# Altium project TE0706.PrjPCB
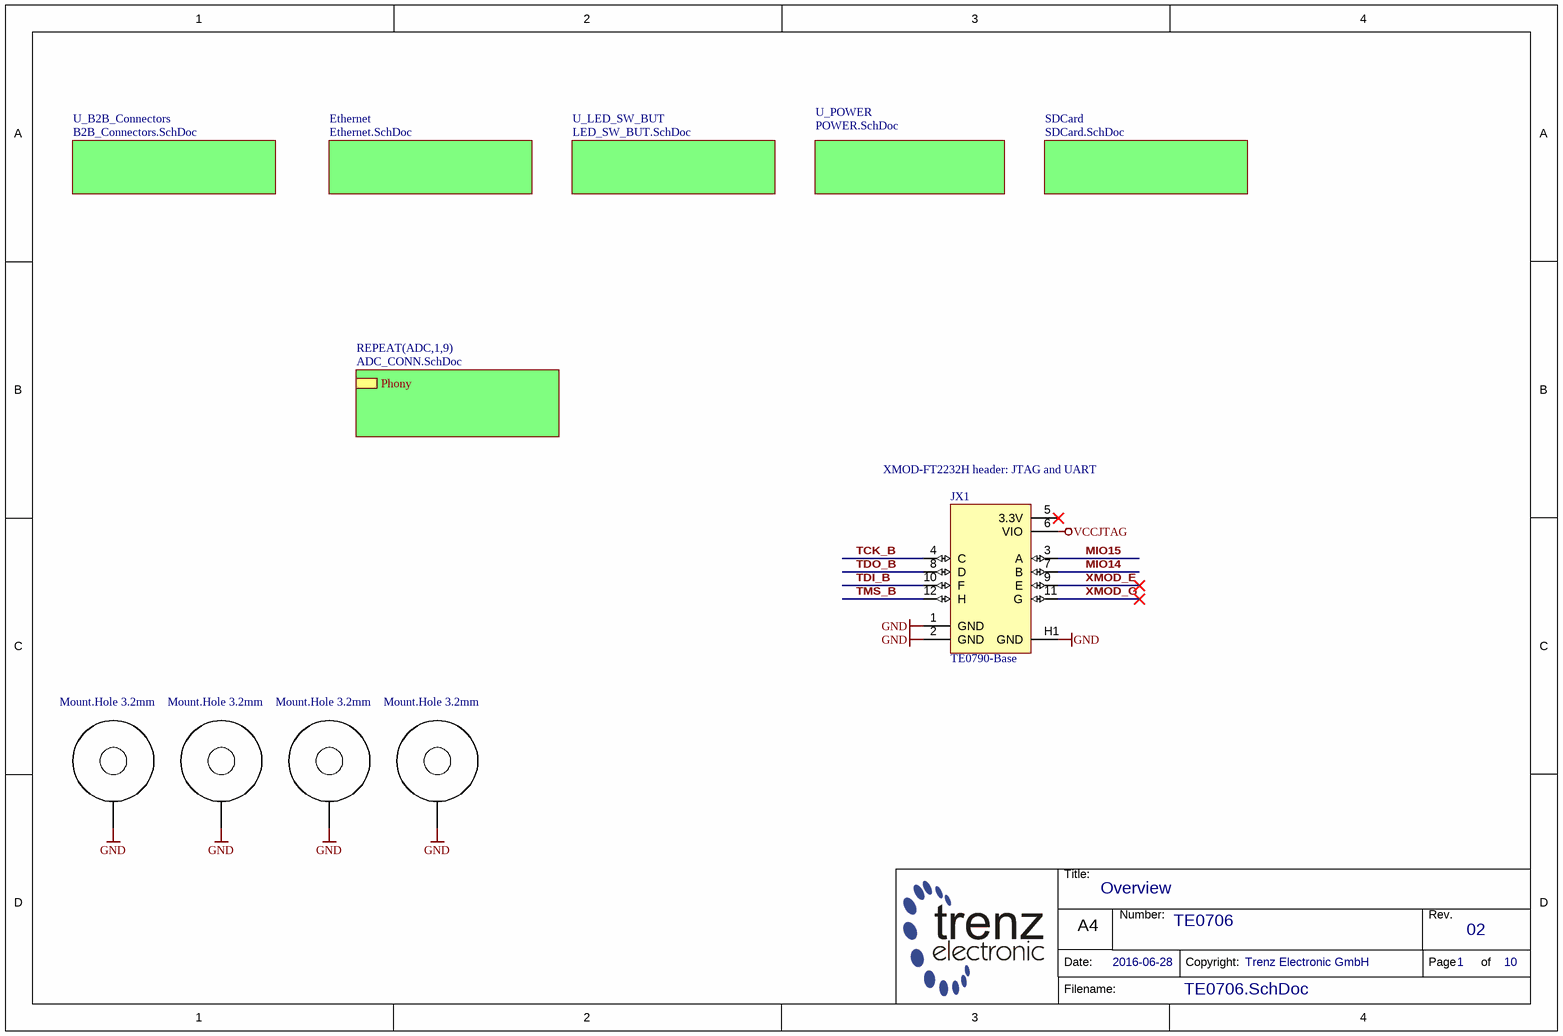
[diagram p0: TE0706.SchDoc]
PrjRev: 01; PrjName: TE0706
7 sheets, 69 parts. Net scope: hierarchical (ports join the sheet entries above them; power ports are global).
Board file: TE0706.PcbDoc
Sheets:
  TE0706.SchDoc
    Ethernet = Ethernet.SchDoc
    SDCard = SDCard.SchDoc
    U_B2B_Connectors = B2B_Connectors.SchDoc
    U_POWER = POWER.SchDoc
    U_LED_SW_BUT = LED_SW_BUT.SchDoc
    ADC1 = ADC_CONN.SchDoc
    ADC2 = ADC_CONN.SchDoc
    ADC3 = ADC_CONN.SchDoc
    ADC4 = ADC_CONN.SchDoc
    ADC5 = ADC_CONN.SchDoc
    ADC6 = ADC_CONN.SchDoc
    ADC7 = ADC_CONN.SchDoc
    ADC8 = ADC_CONN.SchDoc
    ADC9 = ADC_CONN.SchDoc

## Sheet TE0706.SchDoc: Overview
size A4; Organization: Trenz Electronic GmbH; DocumentNumber: TE0706; Revision: 02; SheetNumber: 1; SheetTotal: 10; Date: 2016-06-28; Author: Vitali Tsiukala; DrawnBy: Vitali Tsiukala; Engineer: Vitali Tsiukala

### Parts
H1  Mount.Hole 3.2mm  [MHole3_2mm]  (no BOM)
H2  Mount.Hole 3.2mm  [MHole3_2mm]  (no BOM)
H3  Mount.Hole 3.2mm  [MHole3_2mm]  (no BOM)
H4  Mount.Hole 3.2mm  [MHole3_2mm]  (no BOM)
JX1  TE0790-Base  [TE0790-Base]

### Sub-sheets
Ethernet = Ethernet.SchDoc: no entries
REPEAT(ADC,1,9) = ADC_CONN.SchDoc: Phony
SDCard = SDCard.SchDoc: no entries
U_B2B_Connectors = B2B_Connectors.SchDoc: no entries
U_LED_SW_BUT = LED_SW_BUT.SchDoc: no entries
U_POWER = POWER.SchDoc: no entries

### Nets
GND: H1.1 H2.1 H3.1 H4.1 JX1.1(GND) JX1.2(GND) JX1.H1(GND)
VCCJTAG: JX1.6(VIO)
MIO14: JX1.7(B)
MIO15: JX1.3(A)
TCK_B: JX1.4(C)
TDI_B: JX1.10(F)
TDO_B: JX1.8(D)
TMS_B: JX1.12(H)
XMOD_E: JX1.9(E)
XMOD_G: JX1.11(G)

Not connected (* = marked no-connect by the designer): JX1 5(3.3V)*

### Notes on the sheet
- (near JX1) XMOD-FT2232H header: JTAG and UART
- Title:
- Number:
- Rev.
- Date:
- A4
- Copyright:
- Page
- of
- Filename:

### Library data of the parts
H1-H4 = 22898: AN: 22898; Mixed: THT
JX1 = 26694: AN: 26694; Mixed: THT; Trenz-Article-Number: 22495

## Sheet Ethernet.SchDoc: Ethernet
size A4; Date: 2016-06-28; Author: Vitali Tsiukala; DrawnBy: Vitali Tsiukala; Engineer: Vitali Tsiukala; Organization: Trenz Electronic GmbH; DocumentNumber: TE0706; Revision: 02; SheetNumber: 4; SheetTotal: 10
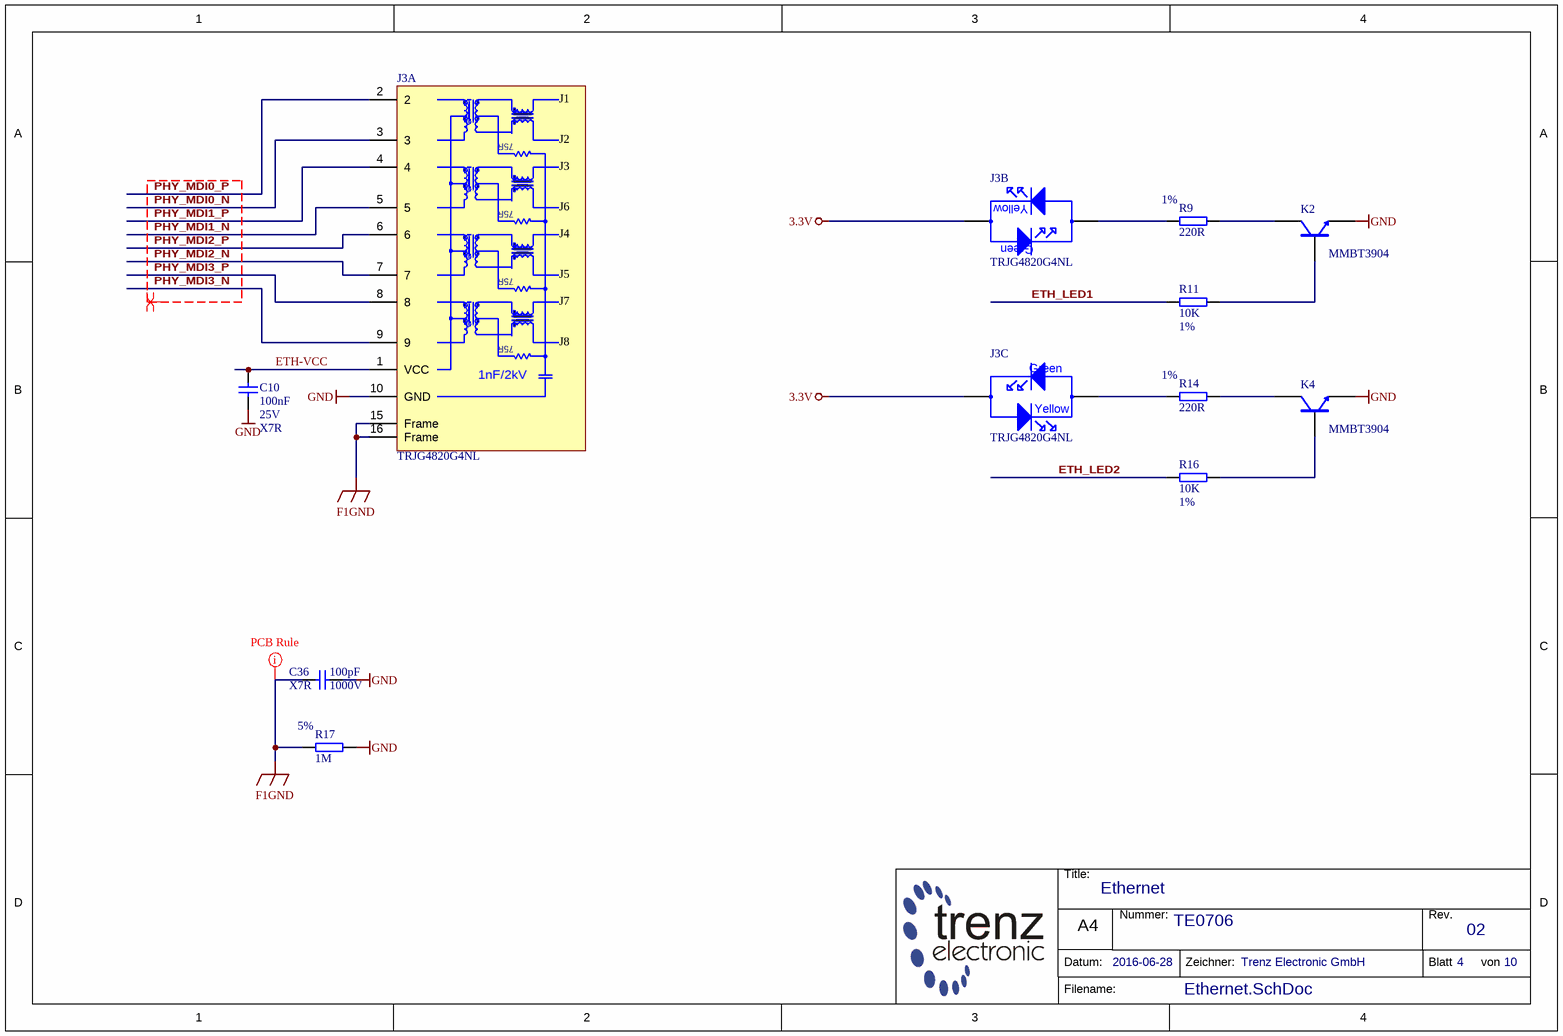
[diagram p1: Ethernet.SchDoc]

### Parts
C10  100nF  Voltage: 25V  Technology: X7R  [CAPC1005X55N]
C36  100pF  Voltage: X7R  Technology: 1000V  [CAPC3216X180N]
J3  TRJG4820G4NL  [MIC38013-5151T-LF3]  (parts A,B,C of 3)
K2  MMBT3904  [SOT95P280X145-3N]
K4  MMBT3904  [SOT95P280X145-3N]
R9  220R  Tolerance: 1%  [RESC1005X40N]
R11  10K  Tolerance: 1%  [RESC1005X40N]
R14  220R  Tolerance: 1%  [RESC1005X40N]
R16  10K  Tolerance: 1%  [RESC1005X40N]
R17  1M  Tolerance: 5%  [RESC3216X65N]

### Nets
3.3V: J3.11(GREEN) J3.14(YELLOW)
F1GND: C36.1 J3.15(Frame) J3.16(Frame) R17.1
GND: C10.1 C36.2 J3.10(GND) K2.2(EMITTER) K4.2(EMITTER) R17.2
ETH-VCC: C10.2 J3.1(VCC)
ETH_LED1: R11.1
ETH_LED2: R16.1
PHY_MDI0_N: J3.3
PHY_MDI0_P: J3.2
PHY_MDI1_N: J3.5
PHY_MDI1_P: J3.4
PHY_MDI2_N: J3.7
PHY_MDI2_P: J3.6
PHY_MDI3_N: J3.9
PHY_MDI3_P: J3.8
NetJ3_12: J3.12(YELLOW) R9.1
NetJ3_13: J3.13(GREEN) R14.1
NetK2_1: K2.1(BASIS) R11.2
NetK2_3: K2.3(COLLECTOR) R9.2
NetK4_1: K4.1(BASIS) R16.2
NetK4_3: K4.3(COLLECTOR) R14.2

### Layout directives
rule Clearance Constraint [Clearance = 0.5mm]: F1GND
differential pair: PHY_MDI0_N, PHY_MDI0_P, PHY_MDI1_N, PHY_MDI1_P, PHY_MDI2_N, PHY_MDI2_P, PHY_MDI3_N, PHY_MDI3_P

### Notes on the sheet
- Title:
- Nummer:
- Rev.
- Datum:
- A4
- Zeichner:
- Blatt
- von
- Filename:
- (in symbol 27357, part A) J1; 75R; J2; J6; J4; J5; J7; J8; 1nF/2kV
- (in symbol 27357, part B) Yellow; Green
- (in symbol 27357, part C) Green; Yellow

### Library data of the parts
C10 = 22472: KON 100nF 25V X5R SMD; AN: 22472; Value: 100n; Mixed: SMT; Preferred: Yes; Case: 1005 (0402)
C36 = 22679: KON 100pF 1000V X7R 10%; AN: 22679; Value: 100p; Preferred: Yes; Mixed: SMT; Case: 3216 (1206); Tolerance: 10%
J3 = 27357: LAN-Transformer 10/100/1000 BaseT; AN: 27357; Trenz-Stock: Yes; Mixed: THT; HelpURL: B:\ad\adlib\datasheet\TRJG4820G4NL; Technology: -40 to +85 °C; H-ART: TRJG4820G4NL
K2 K4 = 23806: AN: 23806; Mixed: SMT; Trenz-Stock: Yes; Case: SOT23-3; HelpURL: B:\AD\adlib\datasheet\MMBT3904; Preferred: Yes; H-ART: MMBT3904
R9 R14 = 22767: WID SMD 220R 1% 0,063W; AN: 22767; Mixed: SMT; Value: 220; Preferred: Yes; Case: 1005 (0402); Technology: TK100
R11 R16 = 22750: WID SMD 10K 1% 0,063W; AN: 22750; Mixed: SMT; Preferred: Yes; Case: 1005 (0402); Value: 10K; Technology: TK100
R17 = 22757: WID SMD 1M 5% 0,25W; AN: 22757; Mixed: SMT; Preferred: Yes; Case: 3216 (1206); Value: 1M; Technology: TK100

## Sheet SDCard.SchDoc: SD Card
size A4; Date: 2016-06-28; Author: Vitali Tsiukala; DrawnBy: Vitali Tsiukala; Engineer: Vitali Tsiukala; Organization: Trenz Electronic GmbH; DocumentNumber: TE0706; Revision: 02; SheetNumber: 7; SheetTotal: 10
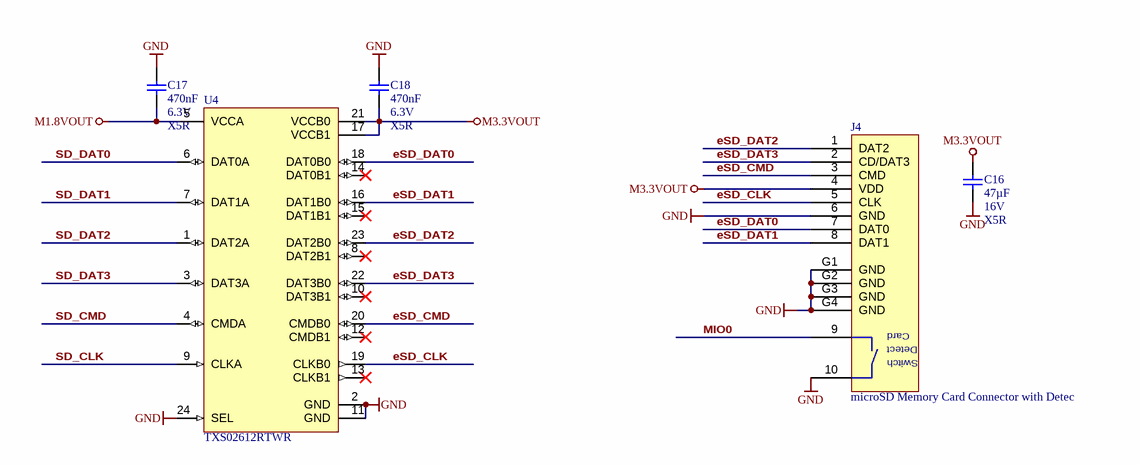
[diagram p2: SDCard.SchDoc]

### Parts
C16  47µF  Voltage: 16V  Technology: X5R  [CAPC3216X180N]
C17  470nF  Voltage: 6.3V  Technology: X5R  [CAPC1005X55N]
C18  470nF  Voltage: 6.3V  Technology: X5R  [CAPC1005X55N]
J4  microSD Memory Card Connector with Detec  [104031-0811]
U4  TXS02612RTWR  [QFN50P400X400X80-25N-255]

### Nets
GND: C16.1 C17.2 C18.2 J4.6(GND) J4.10(CDSW) J4.G1(GND) J4.G2(GND) J4.G3(GND) J4.G4(GND) U4.2(GND) U4.11(GND) U4.24(SEL)
M1.8VOUT: C17.1 U4.5(VCCA)
M3.3VOUT: C16.2 C18.1 J4.4(VDD) U4.17(VCCB1) U4.21(VCCB0)
eSD_CLK: J4.5(CLK) U4.19(CLKB0)
eSD_CMD: J4.3(CMD) U4.20(CMDB0)
eSD_DAT0: J4.7(DAT0) U4.18(DAT0B0)
eSD_DAT1: J4.8(DAT1) U4.16(DAT1B0)
eSD_DAT2: J4.1(DAT2) U4.23(DAT2B0)
eSD_DAT3: J4.2(CD/DAT3) U4.22(DAT3B0)
MIO0: J4.9(CDSW)
SD_CLK: U4.9(CLKA)
SD_CMD: U4.4(CMDA)
SD_DAT0: U4.6(DAT0A)
SD_DAT1: U4.7(DAT1A)
SD_DAT2: U4.1(DAT2A)
SD_DAT3: U4.3(DAT3A)

Not connected (* = marked no-connect by the designer): U4 8(DAT2B1)* 10(DAT3B1)* 12(CMDB1)* 13(CLKB1)* 14(DAT0B1)* 15(DAT1B1)*

### Notes on the sheet
- Title:
- Number:
- Rev.
- Date:
- A4
- Copyright:
- Page
- of
- Filename:
- (in symbol 26322) Card; Detect; Switch

### Library data of the parts
C16 = 24955: KON 47µF 16V  X5R SMD 20%; AN: 24955; Value: 47u; Mixed: SMT; Preferred: Yes; Case: 3216 (1206); Tolerance: 20%
C17 C18 = 23659: KON 470nF 6,3V X5R SMD; AN: 23659; Value: 470n; Mixed: SMT; Preferred: Yes; Case: 1005 (0402)
J4 = 26322: microSD Memory Card Connector with Detect Switch; AN: 26322; Mixed: SMT; Trenz-Stock: Yes; Case: microSD; HelpURL: B:\AD\adlib\datasheet\104031-0811; H-ART: 104031-0811
U4 = 24904: AN: 24904; Trenz-Stock: Yes; Mixed: SMT; Case: QFN24; HelpURL: B:\AD\adlib\datasheet\TXS02612; H-ART: TXS02612RTWR

## Sheet B2B_Connectors.SchDoc: B2B Connector
size A4; Organization: Trenz Electronic GmbH; DocumentNumber: TE0706; Revision: 02; SheetNumber: 2; SheetTotal: 10; Date: 2016-06-28; Author: Vitali Tsiukala; DrawnBy: Vitali Tsiukala; Engineer: Vitali Tsiukala; PageSetup: Record=PageOptions|CenterHorizontal=True|CenterVertical=True|PrintScale=0.97|XCorrection=1.00|YCorrection=1.00|PrintKind=0|BorderSize=5000000|LeftOffset=0|BottomOffset=0|Orientation=2|PaperLength=2970|PaperWidth=2100|Scale=100|PaperSource=7|PrintQuality=600|MediaType=1|DitherType=10|PrintScaleMode=1|PaperKind=A4|PaperIndex=9
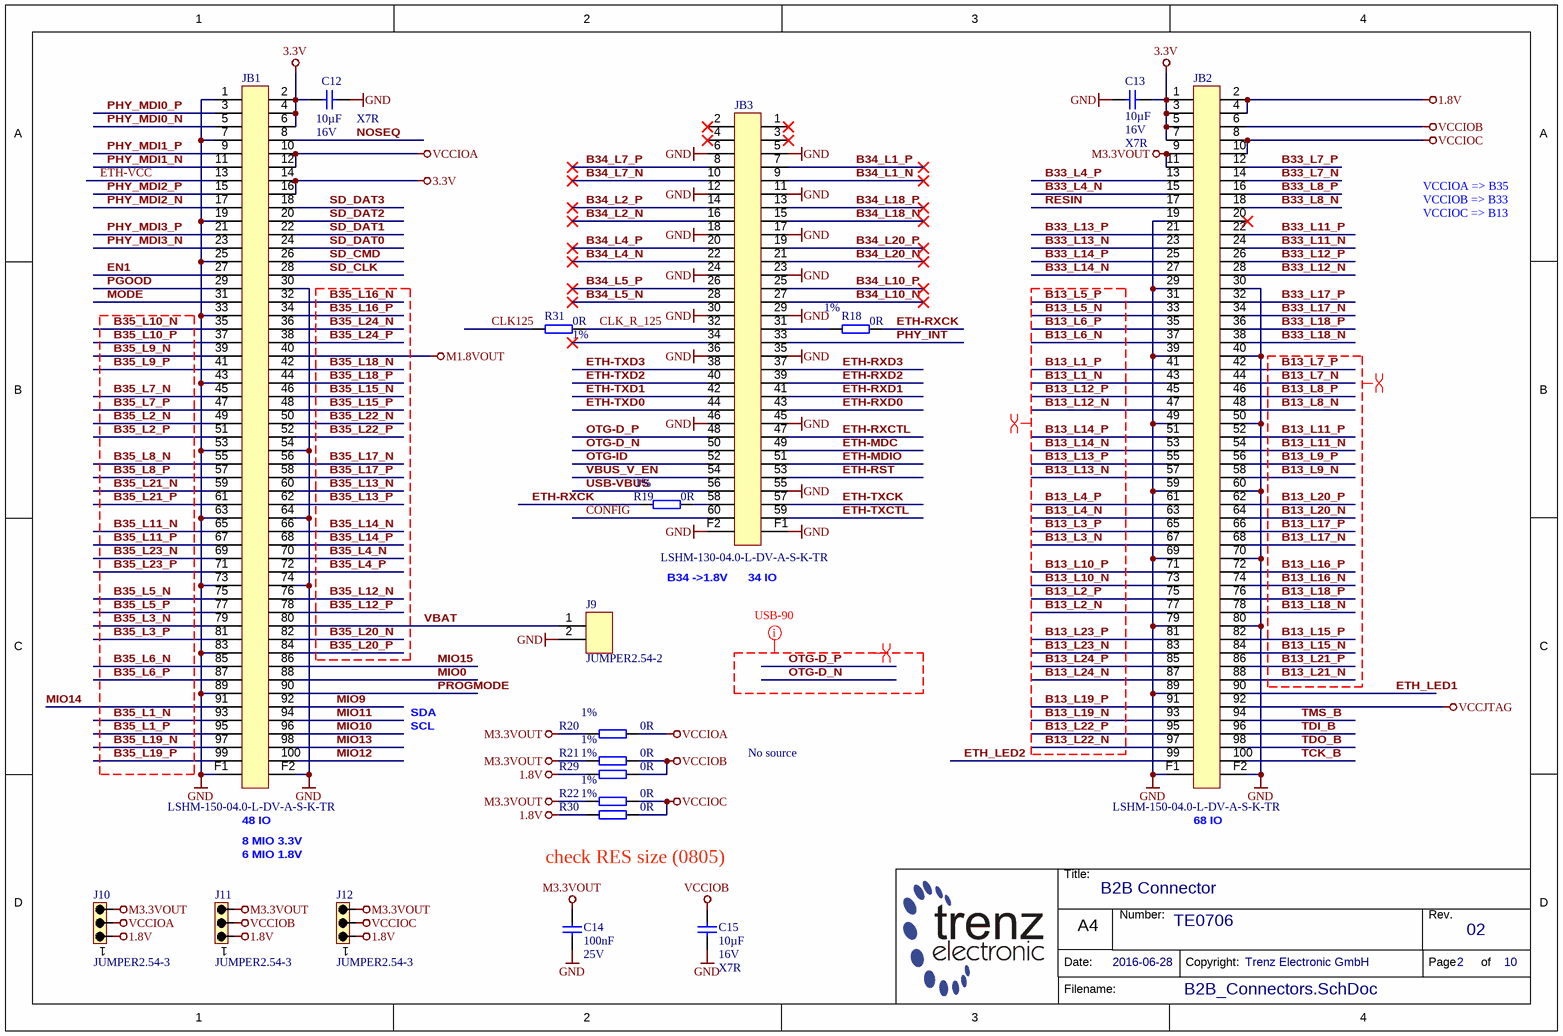
[diagram p3: B2B_Connectors.SchDoc]

### Parts
C12  10µF  Voltage: 16V  Technology: X7R  [CAPC2012X135N]
C13  10µF  Voltage: 16V  Technology: X7R  [CAPC2012X135N]
C14  100nF  Voltage: 25V  [CAPC1005X55N]
C15  10µF  Voltage: 16V  Technology: X7R  [CAPC2012X135N]
J9  JUMPER2.54-2  [JUMPER2_54-2]
J10  JUMPER2.54-3  [JUMPER2_54-3]
J11  JUMPER2.54-3  [JUMPER2_54-3]
J12  JUMPER2.54-3  [JUMPER2_54-3]
JB1  LSHM-150-04.0-L-DV-A-S-K-TR  [LSHM-150-XXX-X-DV-A-X]
JB2  LSHM-150-04.0-L-DV-A-S-K-TR  [LSHM-150-XXX-X-DV-A-X]
JB3  LSHM-130-04.0-L-DV-A-S-K-TR  [LSHM-130-04.0-x-DV-A-S-K-TR]
R18  0R  Tolerance: 1%  [RESC1005X40N]
R19  0R  Tolerance: 1%  [RESC1005X40N]
R20  0R  Tolerance: 1%  [RESC2012X60N]
R21  0R  Tolerance: 1%  [RESC2012X60N]
R22  0R  Tolerance: 1%  [RESC2012X60N]
R29  0R  Tolerance: 1%  [RESC2012X60N]
R30  0R  Tolerance: 1%  [RESC2012X60N]
R31  0R  Tolerance: 1%  [RESC1005X40N]

### Nets
1.8V: J10.1 J11.1 J12.1 JB2.2 JB2.4 R29.1 R30.1
3.3V: C12.2 C13.2 JB1.2 JB1.4 JB1.6 JB1.14 JB1.16 JB2.1 JB2.3 JB2.5 JB2.7
GND: C12.1 C13.1 C14.2 C15.1 J9.2 JB1.1 JB1.7 JB1.19 JB1.25 JB1.30 JB1.33 JB1.43 JB1.53 JB1.54 JB1.63 JB1.64 JB1.73 JB1.74 JB1.83 JB1.89 JB1.F1(Shield) JB1.F2(Shield) JB2.19 JB2.29 JB2.30 JB2.39 JB2.40 JB2.49 JB2.50 JB2.59 JB2.60 JB2.69 JB2.70 JB2.79 JB2.80 JB2.89 JB2.F1(Shield) JB2.F2(Shield) JB3.5 JB3.6 JB3.11 JB3.12 JB3.17 JB3.18 JB3.23 JB3.24 JB3.29 JB3.30 JB3.35 JB3.36 JB3.45 JB3.46 JB3.55 JB3.F1(Shield) JB3.F2(Shield)
M1.8VOUT: JB1.40
M3.3VOUT: C14.1 J10.3 J11.3 J12.3 JB2.9 JB2.11 R20.1 R21.1 R22.1
VCCIOA: J10.2 JB1.10 JB1.12 R20.2
VCCIOB: C15.2 J11.2 JB2.6 R21.2 R29.2
VCCIOC: J12.2 JB2.8 JB2.10 R22.2 R30.2
VCCJTAG: JB2.92
B13_L1_N: JB2.43
B13_L1_P: JB2.41
B13_L2_N: JB2.77
B13_L2_P: JB2.75
B13_L3_N: JB2.67
B13_L3_P: JB2.65
B13_L4_N: JB2.63
B13_L4_P: JB2.61
B13_L5_N: JB2.33
B13_L5_P: JB2.31
B13_L6_N: JB2.37
B13_L6_P: JB2.35
B13_L7_N: JB2.44
B13_L7_P: JB2.42
B13_L8_N: JB2.48
B13_L8_P: JB2.46
B13_L9_N: JB2.58
B13_L9_P: JB2.56
B13_L10_N: JB2.73
B13_L10_P: JB2.71
B13_L11_N: JB2.54
B13_L11_P: JB2.52
B13_L12_N: JB2.47
B13_L12_P: JB2.45
B13_L13_N: JB2.57
B13_L13_P: JB2.55
B13_L14_N: JB2.53
B13_L14_P: JB2.51
B13_L15_N: JB2.84
B13_L15_P: JB2.82
B13_L16_N: JB2.74
B13_L16_P: JB2.72
B13_L17_N: JB2.68
B13_L17_P: JB2.66
B13_L18_N: JB2.78
B13_L18_P: JB2.76
B13_L19_N: JB2.93
B13_L19_P: JB2.91
B13_L20_N: JB2.64
B13_L20_P: JB2.62
B13_L21_N: JB2.88
B13_L21_P: JB2.86
B13_L22_N: JB2.97
B13_L22_P: JB2.95
B13_L23_N: JB2.83
B13_L23_P: JB2.81
B13_L24_N: JB2.87
B13_L24_P: JB2.85
B33_L4_N: JB2.15
B33_L4_P: JB2.13
B33_L7_N: JB2.14
B33_L7_P: JB2.12
B33_L8_N: JB2.18
B33_L8_P: JB2.16
B33_L11_N: JB2.24
B33_L11_P: JB2.22
B33_L12_N: JB2.28
B33_L12_P: JB2.26
B33_L13_N: JB2.23
B33_L13_P: JB2.21
B33_L14_N: JB2.27
B33_L14_P: JB2.25
B33_L17_N: JB2.34
B33_L17_P: JB2.32
B33_L18_N: JB2.38
B33_L18_P: JB2.36
B34_L1_N: JB3.9
B34_L1_P: JB3.7
B34_L2_N: JB3.16
B34_L2_P: JB3.14
B34_L4_N: JB3.22
B34_L4_P: JB3.20
B34_L5_N: JB3.28
B34_L5_P: JB3.26
B34_L7_N: JB3.10
B34_L7_P: JB3.8
B34_L10_N: JB3.27
B34_L10_P: JB3.25
B34_L18_N: JB3.15
B34_L18_P: JB3.13
B34_L20_N: JB3.21
B34_L20_P: JB3.19
B35_L1_N: JB1.93
B35_L1_P: JB1.95
B35_L2_N: JB1.49
B35_L2_P: JB1.51
B35_L3_N: JB1.79
B35_L3_P: JB1.81
B35_L4_N: JB1.70
B35_L4_P: JB1.72
B35_L5_N: JB1.75
B35_L5_P: JB1.77
B35_L6_N: JB1.85
B35_L6_P: JB1.87
B35_L7_N: JB1.45
B35_L7_P: JB1.47
B35_L8_N: JB1.55
B35_L8_P: JB1.57
B35_L9_N: JB1.39
B35_L9_P: JB1.41
B35_L10_N: JB1.35
B35_L10_P: JB1.37
B35_L11_N: JB1.65
B35_L11_P: JB1.67
B35_L12_N: JB1.76
B35_L12_P: JB1.78
B35_L13_N: JB1.60
B35_L13_P: JB1.62
B35_L14_N: JB1.66
B35_L14_P: JB1.68
B35_L15_N: JB1.46
B35_L15_P: JB1.48
B35_L16_N: JB1.32
B35_L16_P: JB1.34
B35_L17_N: JB1.56
B35_L17_P: JB1.58
B35_L18_N: JB1.42
B35_L18_P: JB1.44
B35_L19_N: JB1.97
B35_L19_P: JB1.99
B35_L20_N: JB1.82
B35_L20_P: JB1.84
B35_L21_N: JB1.59
B35_L21_P: JB1.61
B35_L22_N: JB1.50
B35_L22_P: JB1.52
B35_L23_N: JB1.69
B35_L23_P: JB1.71
B35_L24_N: JB1.36
B35_L24_P: JB1.38
CLK125: R31.1
CLK_R_125: JB3.32 R31.2
CONFIG: JB3.60
EN1: JB1.27
ETH-MDC: JB3.49
ETH-MDIO: JB3.51
ETH-RST: JB3.53
ETH-RXCK: R18.2 R19.1
ETH-RXCTL: JB3.47
ETH-RXD0: JB3.43
ETH-RXD1: JB3.41
ETH-RXD2: JB3.39
ETH-RXD3: JB3.37
ETH-TXCK: JB3.57
ETH-TXCTL: JB3.59
ETH-TXD0: JB3.44
ETH-TXD1: JB3.42
ETH-TXD2: JB3.40
ETH-TXD3: JB3.38
ETH-VCC: JB1.13
ETH_LED1: JB2.90
ETH_LED2: JB2.99
MIO0: JB1.88
MIO9: JB1.92
MIO10: JB1.96
MIO11: JB1.94
MIO12: JB1.100
MIO13: JB1.98
MIO14: JB1.91
MIO15: JB1.86
MODE: JB1.31
NOSEQ: JB1.8
OTG-D_N: JB3.50
OTG-D_P: JB3.48
OTG-ID: JB3.52
PGOOD: JB1.29
PHY_INT: JB3.33
PHY_MDI0_N: JB1.5
PHY_MDI0_P: JB1.3
PHY_MDI1_N: JB1.11
PHY_MDI1_P: JB1.9
PHY_MDI2_N: JB1.17
PHY_MDI2_P: JB1.15
PHY_MDI3_N: JB1.23
PHY_MDI3_P: JB1.21
PROGMODE: JB1.90
RESIN: JB2.17
SD_CLK: JB1.28
SD_CMD: JB1.26
SD_DAT0: JB1.24
SD_DAT1: JB1.22
SD_DAT2: JB1.20
SD_DAT3: JB1.18
TCK_B: JB2.100
TDI_B: JB2.96
TDO_B: JB2.98
TMS_B: JB2.94
USB-VBUS: JB3.56
VBAT: J9.1 JB1.80
VBUS_V_EN: JB3.54
NetJB3_31: JB3.31 R18.1
NetJB3_58: JB3.58 R19.2

Not connected (* = marked no-connect by the designer): JB2 20*; JB3 1* 2* 3* 4* 34*

### Layout directives
differential pair: B13_L1_N, B13_L1_P, B13_L2_N, B13_L2_P, B13_L3_N, B13_L3_P, B13_L4_N, B13_L4_P, B13_L5_N, B13_L5_P, B13_L6_N, B13_L6_P, B13_L7_N, B13_L7_P, B13_L8_N, B13_L8_P, B13_L9_N, B13_L9_P, B13_L10_N, B13_L10_P, B13_L11_N, B13_L11_P, B13_L12_N, B13_L12_P, B13_L13_N, B13_L13_P, B13_L14_N, B13_L14_P, B13_L15_N, B13_L15_P, B13_L16_N, B13_L16_P, B13_L17_N, B13_L17_P, B13_L18_N, B13_L18_P, B13_L19_N, B13_L19_P, B13_L20_N, B13_L20_P, B13_L21_N, B13_L21_P, B13_L22_N, B13_L22_P, B13_L23_N, B13_L23_P, B13_L24_N, B13_L24_P, OTG-D_N, OTG-D_P
net class USB-90: OTG-D_N, OTG-D_P

### Notes on the sheet
- VCCIOB => B33
- VCCIOC => B13
- VCCIOA => B35
- B34 ->1.8V
- (near JB3) 34 IO
- SDA
- SCL
- No source
- (near JB1) 48 IO
- 8 MIO 3.3V
- (near JB2) 68 IO
- 6 MIO 1.8V
- check RES size (0805)
- Title:
- Number:
- Rev.
- Date:
- A4
- Copyright:
- Page
- of
- Filename:

### Library data of the parts
C12 C13 C15 = 24380: KON 10µF 16V X7R SMD 10%; AN: 24380; Value: 10u; Mixed: SMT; Preferred: Yes; Case: 2012 (0805); Tolerance: 10%
C14 = 22472: KON 100nF 25V X5R SMD; AN: 22472; Mixed: SMT; Value: 100n; Preferred: Yes; Technology: X7R; Case: 1005 (0402)
J9 = 27212: Stiftleiste gerade 1-reihig, 2pol.; AN: 27212; Mixed: THT; Trenz-Stock: Yes
J10-J12 = 22328: Stiftleiste gerade 1-reihig, 3pol.; AN: 22328; Mixed: THT; Trenz-Stock: Yes
JB1 JB2 = 23838: Samtec Razor Beam REF⁃189016⁃02, LF-04.0, 100 Pins, für alle 4x5 SoMs; AN: 23838; Trenz-Stock: Yes; Mixed: SMT; HelpURL: B:\AD\adlib\datasheet\LSHM-1XX-XX-XXX-DV-A; Preferred: Yes; H-ART: REF⁃189016⁃02
JB3 = 24903: Samtec Razor Beam REF⁃189017⁃02, LF-04.0, 60 Pins, für alle 4x5 SoMs; AN: 24903; Trenz-Stock: Yes; Mixed: SMT; HelpURL: B:\AD\adlib\datasheet\LSHM-1XX-XX-XXX-DV-A; H-ART: REF⁃189017⁃02
R18 R19 R31 = 22738: WID SMD 0R; AN: 22738; Mixed: SMT; Value: 0; Preferred: Yes; Case: 1005 (0402); Technology: TK100
R20-R22 R29 R30 = 23415: WID SMD 0R 0.125W 2A Brücke; AN: 23415; Mixed: SMT; Value: 0; Preferred: Yes; Case: 2012 (0805); Technology: TK100

## Sheet POWER.SchDoc: Power
size A4; Date: 2016-06-28; Author: Vitali Tsiukala; DrawnBy: Vitali Tsiukala; Engineer: Vitali Tsiukala; Organization: Trenz Electronic GmbH; DocumentNumber: TE0706; Revision: 02; SheetNumber: 9; SheetTotal: 10
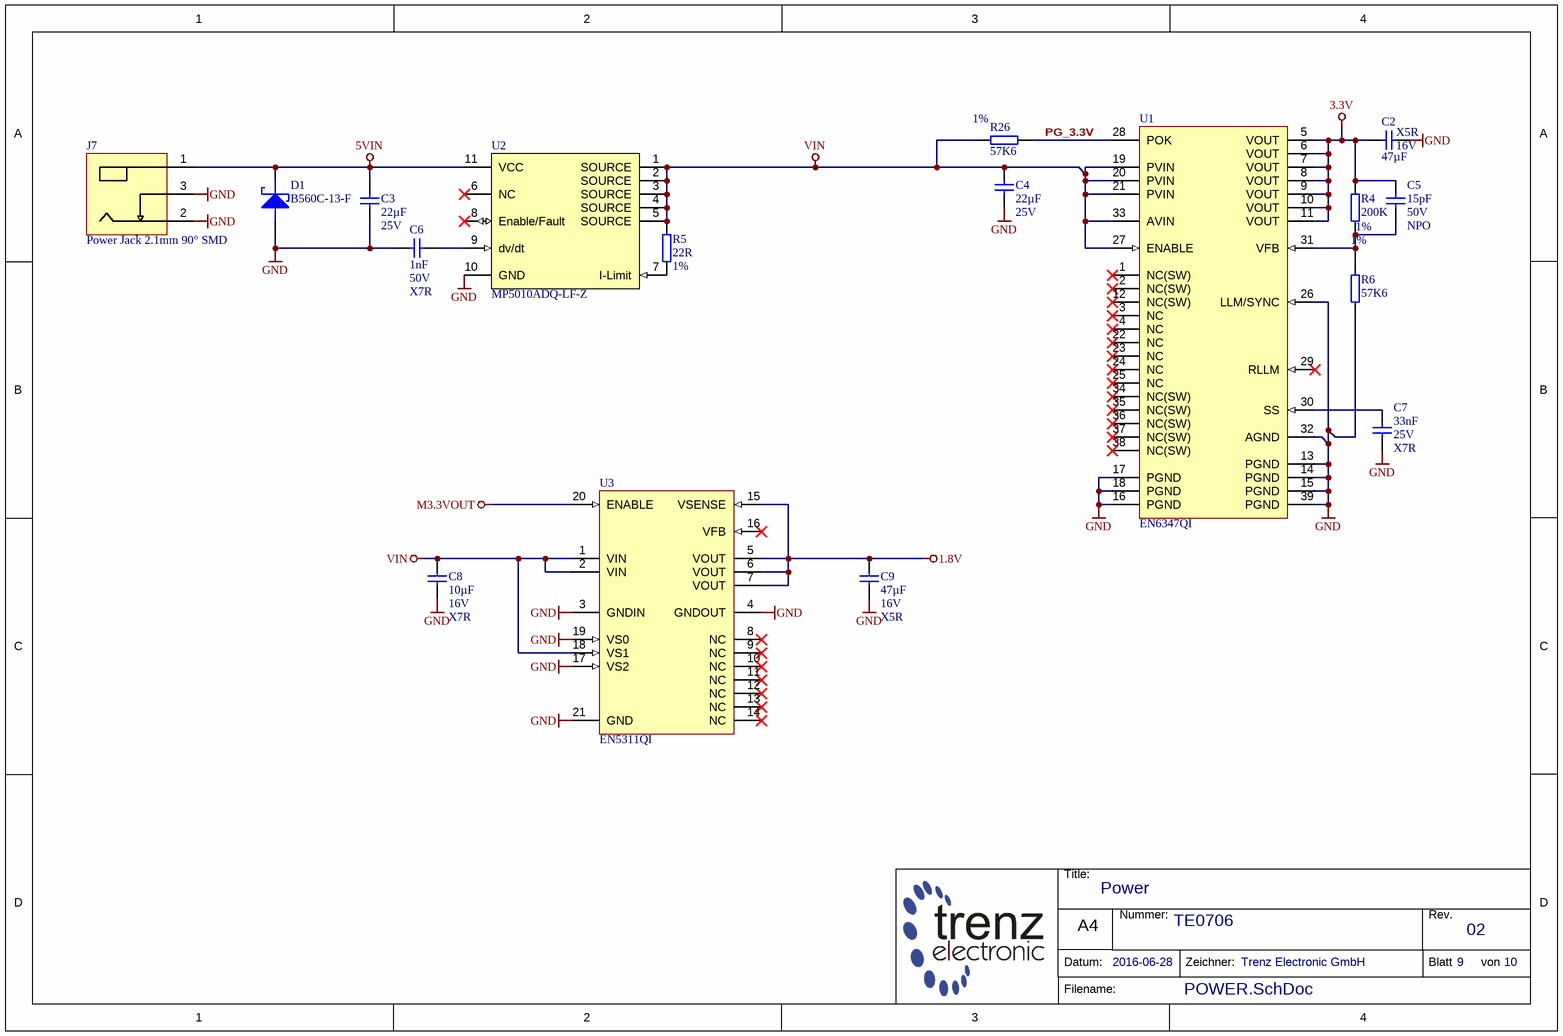
[diagram p4: POWER.SchDoc]

### Parts
C2  47µF  Voltage: 16V  Technology: X5R  [CAPC3216X180N]
C3  22µF  Voltage: 25V  [CAPC3216X180N]
C4  22µF  Voltage: 25V  [CAPC3216X180N]
C5  15pF  Voltage: 50V  Technology: NPO  [CAPC1005X55N]
C6  1nF  Voltage: 50V  Technology: X7R  [CAPC1005X55N]
C7  33nF  Voltage: 25V  Technology: X7R  [CAPC1005X55N]
C8  10µF  Voltage: 16V  Technology: X7R  [CAPC2012X135N]
C9  47µF  Voltage: 16V  Technology: X5R  [CAPC3216X180N]
D1  B560C-13-F  [DIOM7959X250N]
J7  Power Jack 2.1mm 90° SMD  [694106106102]
R4  200K  Tolerance: 1%  [RESC1005X40N]
R5  22R  Tolerance: 1%  [RESC1005X40N]
R6  57K6  Tolerance: 1%  [RESC1005X40N]
R26  57K6  Tolerance: 1%  [RESC1005X40N]
U1  EN6347QI  [EN63xx]
U2  MP5010ADQ-LF-Z  [SON50P300X300X100-11N]
U3  EN5311QI  [EN5311QI]

### Nets
1.8V: C9.1 U3.5(VOUT) U3.6(VOUT) U3.7(VOUT) U3.15(VSENSE)
3.3V: C2.1 C5.1 R4.1 U1.5(VOUT) U1.6(VOUT) U1.7(VOUT) U1.8(VOUT) U1.9(VOUT) U1.10(VOUT) U1.11(VOUT)
5VIN: C3.1 D1.1(KATHODE) J7.1 U2.11(VCC)
GND: C2.2 C3.2 C4.1 C6.1 C7.2 C8.2 C9.2 D1.2(ANODE) J7.2 J7.3 R6.2 U1.13(PGND) U1.14(PGND) U1.15(PGND) U1.16(PGND) U1.17(PGND) U1.18(PGND) U1.26(LLM/SYNC) U1.32(AGND) U1.39(PGND) U2.10(GND) U3.3(GNDIN) U3.4(GNDOUT) U3.17(VS2) U3.19(VS0) U3.21(GND)
M3.3VOUT: U3.20(ENABLE)
VIN: C4.2 C8.1 R5.1 R26.1 U1.19(PVIN) U1.20(PVIN) U1.21(PVIN) U1.27(ENABLE) U1.33(AVIN) U2.1(SOURCE) U2.2(SOURCE) U2.3(SOURCE) U2.4(SOURCE) U2.5(SOURCE) U3.1(VIN) U3.2(VIN) U3.18(VS1)
PG_3.3V: R26.2 U1.28(POK)
NetC5_2: C5.2 R4.2 R6.1 U1.31(VFB)
NetC6_2: C6.2 U2.9(dv/dt)
NetC7_1: C7.1 U1.30(SS)
NetR5_2: R5.2 U2.7(I-Limit)

Not connected (* = marked no-connect by the designer): U1 1(NC(SW))* 2(NC(SW))* 3(NC)* 4(NC)* 12(NC(SW))* 22(NC)* 23(NC)* 24(NC)* 25(NC)* 29(RLLM)* 34(NC(SW))* 35(NC(SW))* 36(NC(SW))* 37(NC(SW))* 38(NC(SW))*; U2 6(NC)* 8(Enable/Fault)*; U3 8(NC)* 9(NC)* 10(NC)* 11(NC)* 12(NC)* 13(NC)* 14(NC)* 16(VFB)*

### Notes on the sheet
- Title:
- Nummer:
- Rev.
- Datum:
- A4
- Zeichner:
- Blatt
- von
- Filename:

### Library data of the parts
C2 = 24955: as C16 on sheet SDCard; Case: 3216 (1206); Tolerance: 20%
C3 = 24886: KON 22µF X5R 25V SMD 10%; AN: 24886; Mixed: SMT; Value: 22u; Preferred: Yes; Case: 3216 (1206); Tolerance: 10%
C4 = 24886: KON 22µF X5R 25V SMD 10%; AN: 24886; Value: 22u; Mixed: SMT; Preferred: Yes; Case: 3216 (1206); Tolerance: 10%
C5 = 23951: KON 15pF NPO 50V SMD; AN: 23951; Value: 15p; Mixed: SMT; Preferred: Yes; Case: 1005 (0402)
C6 = 22471: KON 1nF 50V X7R SMD; AN: 22471; Mixed: SMT; Value: 1n; Tolerance: 10%; Preferred: Yes; Case: 1005 (0402)
C7 = 23916: KON 33nF 25V X7R SMD; AN: 23916; Value: 33n; Mixed: SMT; Preferred: Yes; Case: 1005 (0402)
C8 = 24380: KON 10µF 16V X7R SMD 10%; AN: 24380; Mixed: SMT; Value: 10u; Preferred: Yes; Case: 2012 (0805); Tolerance: 10%
C9 = 24955: KON 47µF 16V  X5R SMD 20%; AN: 24955; Mixed: SMT; Value: 47u; Preferred: Yes; Case: 3216 (1206); Tolerance: 20%
D1 = 25311: B560C-13-F SMD; AN: 25311; Mixed: SMT; Trenz-Stock: Yes; Case: SMC; HelpURL: B:\AD\adlib\datasheet\B520C-B560C; H-ART: B560C-13-F
J7 = 26873: AN: 26873; Mixed: SMT; Trenz-Stock: Yes; HelpURL: B:\ad\adlib\datasheet\694106106102; H-ART: 694106106102
R4 = 23846: WID SMD 200K 1% 0,063W; AN: 23846; Mixed: SMT; Preferred: Yes; Case: 1005 (0402); Value: 200K; Technology: TK100
R5 = 25892: WID SMD 22R 1% 0,063W; AN: 25892; Mixed: SMT; Value: 22; Preferred: Yes; Case: 1005 (0402); Technology: TK100
R6 R26 = 24958: WID SMD 57K6 1% 0,063W; AN: 24958; Value: 57.6K; Mixed: SMT; Preferred: Yes; Case: 1005 (0402); Technology: TK100
U1 = 24486: AN: 24486; Trenz-Stock: Yes; Mixed: SMT; HelpURL: B:\AD\adlib\datasheet\EN6347QI; Preferred: Yes; H-ART: EN6347QI
U2 = 25620: AN: 25620; Mixed: SMT; Voltage: 5V; Case: DFN10; HelpURL: B:\AD\adlib\datasheet\MP5010; H-ART: MP5010ADQ-LF-Z
U3 = 25492: AN: 25492; Mixed: SMT; Trenz-Stock: Yes; Case: QFN20; HelpURL: B:\AD\adlib\datasheet\EN5311QI; Preferred: Yes; H-ART: EN5311QI

## Sheet LED_SW_BUT.SchDoc: LED-Switch
size A4; Date: 2016-06-28; Author: Vitali Tsiukala; DrawnBy: Vitali Tsiukala; Engineer: Vitali Tsiukala; Organization: Trenz Electronic GmbH; DocumentNumber: TE0706; Revision: 02; SheetNumber: 6; SheetTotal: 10
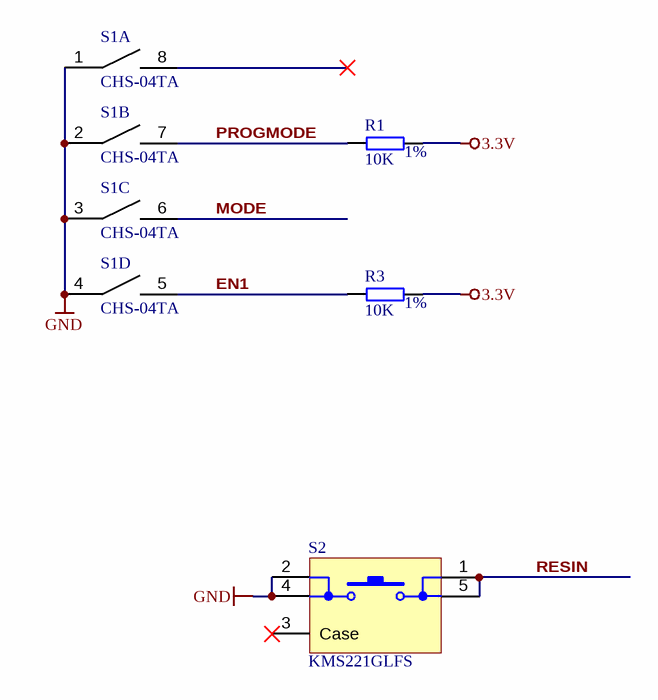
[diagram p5: LED_SW_BUT.SchDoc]

### Parts
R1  10K  Tolerance: 1%  [RESC1005X40N]
R3  10K  Tolerance: 1%  [RESC1005X40N]
S1  CHS-04TA  [CHS-04TA]  (parts A,B,C,D of 4)
S2  KMS221GLFS  [KMS2xxGLFS]

### Nets
3.3V: R1.1 R3.1
GND: S1.1 S1.2 S1.3 S1.4 S2.2 S2.4
EN1: R3.2 S1.5
MODE: S1.6
PROGMODE: R1.2 S1.7
RESIN: S2.1 S2.5

Not connected (* = marked no-connect by the designer): S1 8*; S2 3(Case)*

### Notes on the sheet
- Title:
- Number:
- Rev.
- Date:
- A4
- Copyright:
- Page
- of
- Filename:

### Library data of the parts
R1 R3 = 22750: as R11 on sheet Ethernet; Case: 1005 (0402); Value: 10K; Technology: TK100
S1 = 23417: DIP Schalter 4 fach 1,27mm SMD; AN: 23417; Trenz-Stock: Yes; Mixed: SMT; HelpURL: B:\AD\adlib\datasheet\CHS; Preferred: Yes; H-ART: CHS-04TA
S2 = 26229: KMS221GLFS - SWITCH, SPST, 0.05A, 32VDC, SMD; AN: 26229; Mixed: SMT; HelpURL: B:\AD\adlib\datasheet\KMS; H-ART: KMS221GLFS

## Sheet ADC_CONN.SchDoc
size A
Used 9 times, as channels ADC1, ADC2, ADC3, ADC4, ADC5, ADC6, ADC7, ADC8, ADC9. Parts and nets are listed once, with the designators drawn on the sheet.
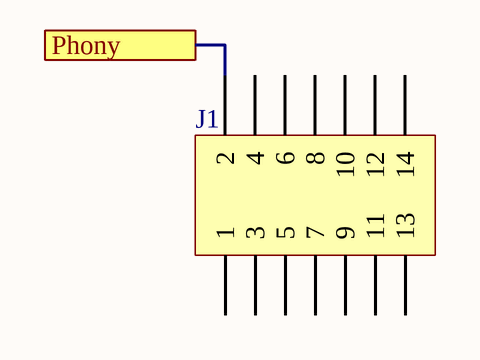
[diagram p6: ADC_CONN.SchDoc]

### Parts
J1  Header 7X2  [CLP-107-02-F-D-A-TR]  (value not drawn)

### Ports
Phony

### Nets
Phony: J1.2 ; port Phony

Not connected (* = marked no-connect by the designer): J1 1 3 4 5 6 7 8 9 10 11 12 13 14

### Channels
ADC1: designators end in .A; ports Phony=NetJ1.A_2
ADC2: designators end in .B; ports Phony=NetJ1.A_2
ADC3: designators end in .C; ports Phony=NetJ1.A_2
ADC4: designators end in .D; ports Phony=NetJ1.A_2
ADC5: designators end in .E; ports Phony=NetJ1.A_2
ADC6: designators end in .F; ports Phony=NetJ1.A_2
ADC7: designators end in .G; ports Phony=NetJ1.A_2
ADC8: designators end in .H; ports Phony=NetJ1.A_2
ADC9: designators end in .I; ports Phony=NetJ1.A_2

### Library data of the parts
J1 = Header 7X2: Header, 7-Pin, Dual row; System: Connector; LatestRevisionDate: 17-Jul-2002; LatestRevisionNote: Re-released for DXP Platform.; Publisher: Altium Limited

## Nets that join several sheets
1.8V: B2B_Connectors (7 pins), POWER (5 pins)
3.3V: Ethernet (J3.11 J3.14), B2B_Connectors (11 pins), POWER (10 pins), LED_SW_BUT (R1.1 R3.1)
GND: TE0706 (7 pins), Ethernet (6 pins), SDCard (12 pins), B2B_Connectors (55 pins), POWER (26 pins), LED_SW_BUT (6 pins)
M1.8VOUT: SDCard (C17.1 U4.5), B2B_Connectors (JB1.40)
M3.3VOUT: SDCard (5 pins), B2B_Connectors (9 pins), POWER (U3.20)
VCCJTAG: TE0706 (JX1.6), B2B_Connectors (JB2.92)
NetJ1.A_2: ADC1 (J1.A.2), ADC2 (J1.B.2), ADC3 (J1.C.2), ADC4 (J1.D.2), ADC5 (J1.E.2), ADC6 (J1.F.2), ADC7 (J1.G.2), ADC8 (J1.H.2), ADC9 (J1.I.2)

## Assembly variants
TE0706: not fitted J8 J9 R20 R21 R22 R27 R29 R30
TE0706-D: not fitted J7 J9 R20 R21 R22 R27 R29 R30